# Altium schematic sheet [5] SCS.SchDoc
size A4
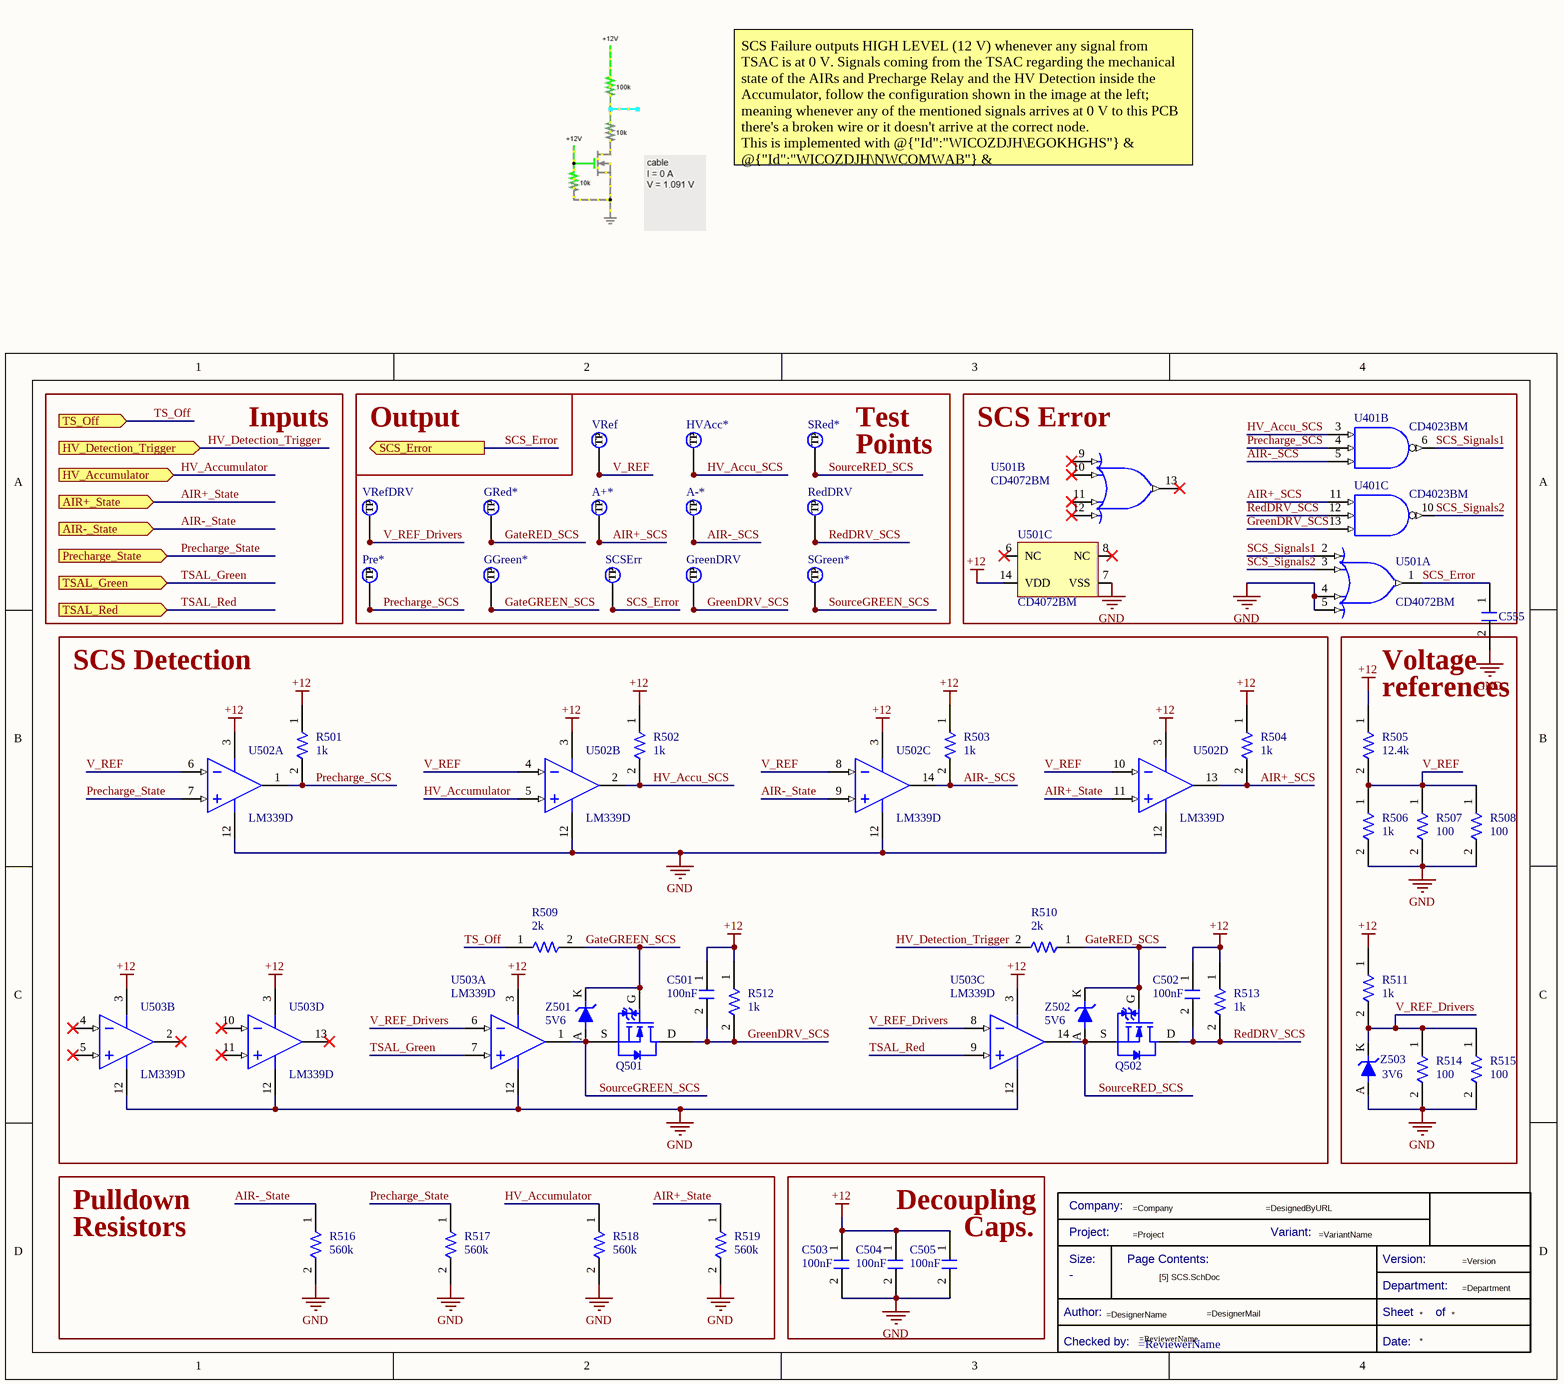
[diagram p0: [5] SCS.SchDoc]

## Parts
*  Title Block_template  (value not drawn)  (graphical)
A+*  TestPoint  [TestPoint]  (value not drawn)  (no BOM)
A-*  TestPoint  [TestPoint]  (value not drawn)  (no BOM)
C501  value 100nF  [C0805FNPC-R]  (hidden comment: C100n-50V-0805FNPC-X7R)
C502  value 100nF  [C0805FNPC-R]  (hidden comment: C100n-50V-0805FNPC-X7R)
C503  value 100nF  [C0805FNPC-R]  (hidden comment: C100n-50V-0805FNPC-X7R)
C504  value 100nF  [C0805FNPC-R]  (hidden comment: C100n-50V-0805FNPC-X7R)
C505  value 100nF  [C0805FNPC-R]  (hidden comment: C100n-50V-0805FNPC-X7R)
C555  C15p-50V-0805FNPC-NP0  [C0805FNPC-R]  (value not drawn)
GGreen*  TestPoint  [TestPoint]  (value not drawn)  (no BOM)
GRed*  TestPoint  [TestPoint]  (value not drawn)  (no BOM)
GreenDRV  TestPoint  [TestPoint]  (value not drawn)  (no BOM)
HVAcc*  TestPoint  [TestPoint]  (value not drawn)  (no BOM)
Pre*  TestPoint  [TestPoint]  (value not drawn)  (no BOM)
Q501  TRT-NCH-8/40-SQ  [TRT-NCH-3/35-CPH]  (value not drawn)
Q502  TRT-NCH-8/40-SQ  [TRT-NCH-3/35-CPH]  (value not drawn)
R501  value 1k  [R0805FTK]  (hidden comment: R1k-0805FTK)
R502  value 1k  [R0805FTK]  (hidden comment: R1k-0805FTK)
R503  value 1k  [R0805FTK]  (hidden comment: R1k-0805FTK)
R504  value 1k  [R0805FTK]  (hidden comment: R1k-0805FTK)
R505  value 12.4k  [0805]  (hidden comment: R12K4-0805-0.125W)
R506  value 1k  [0805]  (hidden comment: R1K-0805-0.5W)
R507  value 100  [R0805FTK]  (hidden comment: R100-0805FTK)
R508  value 100  [R0805FTK]  (hidden comment: R100-0805FTK)
R509  value 2k  [0805]  (hidden comment: R2K_0.5W_0805)
R510  value 2k  [0805]  (hidden comment: R2K_0.5W_0805)
R511  value 1k  [0805]  (hidden comment: R1K-0805-0.5W)
R512  value 1k  [R0805FTK]  (hidden comment: R1k-0805FTK)
R513  value 1k  [R0805FTK]  (hidden comment: R1k-0805FTK)
R514  value 100  [R0805FTK]  (hidden comment: R100-0805FTK)
R515  value 100  [R0805FTK]  (hidden comment: R100-0805FTK)
R516  value 560k  [0805]  (hidden comment: R560K-0805)
R517  value 560k  [0805]  (hidden comment: R560K-0805)
R518  value 560k  [0805]  (hidden comment: R560K-0805)
R519  value 560k  [0805]  (hidden comment: R560K-0805)
RedDRV  TestPoint  [TestPoint]  (value not drawn)  (no BOM)
SCSErr  TestPoint  [TestPoint]  (value not drawn)  (no BOM)
SGreen*  TestPoint  [TestPoint]  (value not drawn)  (no BOM)
SRed*  TestPoint  [TestPoint]  (value not drawn)  (no BOM)
U401  CD4023BM  [D0014A_N]  (parts B,C of 4)
U501  CD4072BM  [D0014A_N]  (parts A,B,C of 3)
U502  LM339D  [D0014A_N]  (parts A,B,C,D of 4)
U503  LM339D  [D0014A_N]  (parts A,B,C,D of 4)
VRef  TestPoint  [TestPoint]  (value not drawn)  (no BOM)
VRefDRV  TestPoint  [TestPoint]  (value not drawn)  (no BOM)
Z501  Zener Voltage: 5V6  [DO-214AC]  (hidden comment: DZ-5.6V-DO-214AC)
Z502  Zener Voltage: 5V6  [DO-214AC]  (hidden comment: DZ-5.6V-DO-214AC)
Z503  Zener Voltage: 3V6  [DZ-DO-214AC]  (hidden comment: DZ-3V6-1.25W-DO-214AC)

## Blocks framed on the sheet
SCS Error: C555 U401 U501
SCS Detection: C501 C502 Q501 Q502 R501-R504 R509 R510 R512 R513 U502 U503 Z501 Z502

## Ports
AIR+_State (in, see [2] Implausibilities[3B], [1] TSAL_Green[2A], [2] Implausibilities[1A], [3] Relay Implausibility[1A]), AIR-_State (in, see [2] Implausibilities[3B], [1] TSAL_Green[2A], [2] Implausibilities[1A], [3] Relay Implausibility[1A]), HV_Accumulator (in, see [2] Implausibilities[3B], [1] TSAL_Green[2B], [2] Implausibilities[1A], [4] NoHV_RelaysClosed[1A]), HV_Detection_Trigger (in, see [2] Implausibilities[4B], [1] TSAL_Green[2B], [2] Implausibilities[1A], [7] TSAL_Red[2A]), Precharge_State (in, see [2] Implausibilities[3C], [1] TSAL_Green[2A], [2] Implausibilities[1A], [3] Relay Implausibility[1A]), SCS_Error (out, see [2] Implausibilities[4C]), TS_Off (in, see [2] Implausibilities[3C], [1] TSAL_Green[4A], [2] Implausibilities[1A], [6] Green_Driver[1A]), TSAL_Green (in, see [2] Implausibilities[4B], [1] TSAL_Green[4A], [2] Implausibilities[1A], [6] Green_Driver[2A]), TSAL_Red (in, see [2] Implausibilities[4B], [1] TSAL_Green[3A], [2] Implausibilities[1A], [7] TSAL_Red[2A], [8] Red_Driver[2A])

## Nets
+12: C501.1 C502.1 C503.1 C504.1 C505.1 R501.1 R502.1 R503.1 R504.1 R505.1 R511.1 R512.1 R513.1 U501.14(VDD) U502.3(VCC) U503.3(VCC)
GND: C503.2 C504.2 C505.2 C555.2 R506.2 R507.2 R508.2 R514.2 R515.2 R516.2 R517.2 R518.2 R519.2 U501.4(C) U501.5(D) U501.7(VSS) U502.12(GND) U503.12(GND) Z503.A
AIR+_SCS: A+*.1(TP) R504.2 U401.11(I) U502.13(OUT4)
AIR+_State: R519.1 U502.11(IN4+) ; port AIR+_State
AIR-_SCS: A-*.1(TP) R503.2 U401.5(F) U502.14(OUT3)
AIR-_State: R516.1 U502.9(IN3+) ; port AIR-_State
GateGREEN_SCS: GGreen*.1(TP) Q501.G R509.2 Z501.K
GateRED_SCS: GRed*.1(TP) Q502.G R510.1 Z502.K
GreenDRV_SCS: C501.2 GreenDRV.1(TP) Q501.D R512.2 U401.13(G)
HV_Accu_SCS: HVAcc*.1(TP) R502.2 U401.3(D) U502.2(OUT2)
HV_Accumulator: R518.1 U502.5(IN2+) ; port HV_Accumulator
HV_Detection_Trigger: R510.2 ; port HV_Detection_Trigger
Precharge_SCS: Pre*.1(TP) R501.2 U401.4(E) U502.1(OUT1)
Precharge_State: R517.1 U502.7(IN1+) ; port Precharge_State
RedDRV_SCS: C502.2 Q502.D R513.2 RedDRV.1(TP) U401.12(H)
SCS_Error: C555.1 SCSErr.1(TP) U501.1(J) ; port SCS_Error
SCS_Signals1: U401.6(K) U501.2(A)
SCS_Signals2: U401.10(L) U501.3(B)
SourceGREEN_SCS: Q501.S SGreen*.1(TP) U503.1(OUT1) Z501.A
SourceRED_SCS: Q502.S SRed*.1(TP) U503.14(OUT3) Z502.A
TS_Off: R509.1 ; port TS_Off
TSAL_Green: U503.7(IN1+) ; port TSAL_Green
TSAL_Red: U503.9(IN3+) ; port TSAL_Red
V_REF: R505.2 R506.1 R507.1 R508.1 U502.4(IN2-) U502.6(IN1-) U502.8(IN3-) U502.10(IN4-) VRef.1(TP)
V_REF_Drivers: R511.2 R514.1 R515.1 U503.6(IN1-) U503.8(IN3-) VRefDRV.1(TP) Z503.K

Not connected (* = marked no-connect by the designer): U501 6(NC)* 8(NC)* 9(E)* 10(F)* 11(G)* 12(H)* 13(K)*; U503 2(OUT2)* 4(IN2-)* 5(IN2+)* 10(IN4-)* 11(IN4+)* 13(OUT4)*

## Notes on the sheet
- SCS Failure outputs HIGH LEVEL (12 V) whenever any signal from TSAC is at 0 V. Signals coming from the TSAC regarding the mechanical state of the AIRs and Precharge Relay and the HV Detection inside the Accumulator, follow the configuration shown in the image at the left; meaning whenever any of the mentioned signals arrives at 0 V to this PCB there's a broken wire or it doesn't arrive at the correct node.
  This is implemented with @{"Id":"WICOZDJH\EGOKHGHS"} & @{"Id":"WICOZDJH\NWCOMWAB"} & @{"Id":"WICOZDJH\OSDIWEFW"} & @{"Id":"WICOZDJH\TEKHYVMJ"}.
- Inputs
- Output
- (near SRed*) Test
- (near SRed*) Points
- Voltage
- references
- Pulldown
- Resistors
- Decoupling
- (near C505) Caps.
- (in symbol CMP-00043-8) Company:; Project:; Variant:; Size:; Page Contents:; Version:; Department:; Author:; Sheet; of; Checked by:; Date:

## Library data of the parts
* = CMP-00043-8: Standard Title Block; .SCHcheck: GP; Checked by:: =ReviewerName; Size: -; Design Item ID: Title Block_template; .PCBcheck: GP; .Creator: GP; Source: e-Tech_Racing.SchLib; Category: Title Block
A+* A-* GGreen* GRed* GreenDRV HVAcc* Pre* RedDRV SCSErr SGreen* SRed* VRef VRefDRV = CMP-00042-2: Test Point 1x1 mm; .SCHcheck: GP; Category: TestPoint; Source: e-Tech_Racing.SchLib; .Creator: GP; .PCBcheck: GP; Design Item ID: TestPoint
C501-C505 = CMP-00063-3: Cap, 0.1ΜF, 50V, 10%, X7R, 0805; Manufacturer Part Number 1: 885012207098; Manufacturer 1: Wurth Electronics; .Creator: DR; ComponentLink2Description: http://www.farnell.com/datasheets/1958498.pdf?src-supplier=Element14; ComponentLink1Description: http://www.farnell.com/datasheets/1958498.pdf?src-supplier=Farnell; Thickness: 0.035inch; ComponentLink1URL: http://www.farnell.com/datasheets/1958498.pdf?src-supplier=Farnell; Min Operating Temperature: -55°C; Packaging: Cut Tape; ComponentLink2URL: http://www.farnell.com/datasheets/1958498.pdf?src-supplier=Element14; Mount: Surface Mount; Voltage Rating (DC): 50V; Tolerance: 10%; Category: Ceramic Capacitors; RoHS: Yes; Width: 0.049inch; Pricing 1: 100=0,10200, 500=0,07100, 2000=0,06100 (GBP); RoHS Compliant: Yes; ComponentLink4Description: http://www.farnell.com/datasheets/1958498.pdf?src-supplier=Newark; Dielectric: X7R; Stock 1: 8000; Length: 0.079inch; ComponentLink3URL: https://katalog.we-online.de/pbs/datasheet/885012207098.pdf?src-supplier=Digi-Key; ComponentLink3Description: https://katalog.we-online.de/pbs/datasheet/885012207098.pdf?src-supplier=Digi-Key; Design Item ID: C100n-50V-0805FNPC-X7R; ComponentLink4URL: http://www.farnell.com/datasheets/1958498.pdf?src-supplier=Newark; REACH SVHC: Unknown; Case Code (Metric): 2012; Voltage Rating: 50V; Max Operating Temperature: 125°C; Source: Passives.SchLib; Case/Package: 0805
C555 = CMP-00056-3: Cap, 15PF, 50V, 5%, C0G/NP0, 0805; Manufacturer Part Number 1: 885012007052; Manufacturer 1: Wurth Electronics; .Creator: DR; Thickness: 0.028inch; RoHS Compliant: Yes; ComponentLink2URL: http://katalog.we-online.de/pbs/datasheet/885012007052.pdf?src-supplier=Digi-Key; Design Item ID: C15p-50V-0805FNPC-NP0; Case Code (Metric): 2012; Max Operating Temperature: 125°C; Mount: Surface Mount; Category: Ceramic Capacitors; Min Operating Temperature: -55°C; Case/Package: 0805; ComponentLink3Description: https://katalog.we-online.de/pbs/datasheet/885012007052.pdf?src-supplier=Digi-Key; ComponentLink1Description: http://www.farnell.com/datasheets/2031702.pdf?src-supplier=Farnell; ComponentLink1URL: http://www.farnell.com/datasheets/2031702.pdf?src-supplier=Farnell; RoHS: Yes; Voltage Rating: 50V; Length: 0.079inch; Source: Passives.SchLib; Value: 15pF; Pricing 1: 1=0,10800, 10=0,05200, 25=0,05100, 50=0,04900, 100=0,04800, 250=0,04600, 500=0,04300 (USD); Tolerance: 5%; ComponentLink3URL: https://katalog.we-online.de/pbs/datasheet/885012007052.pdf?src-supplier=Digi-Key; Stock 1: 815; Packaging: Cut Tape; Width: 0.049inch; ComponentLink2Description: http://katalog.we-online.de/pbs/datasheet/885012007052.pdf?src-supplier=Digi-Key
Q501 Q502 = CMP-00142-1: Automotive N-channel 40 V (d-s) 175C Mosfet SOT-23; Manufacturer Part Number 1: SQ2318BES-T1_GE3; Manufacturer 1: Vishay; Vds: 40V; .Creator: DO; Pricing 1: 1=0,71500, 5=0,71500, 10=0,64400, 25=0,59000, 50=0,52500, 100=0,47100, 250=0,40800 (USD); RoHS: No; ComponentLink2Description: Datasheet; ComponentLink1Description: Where to buy; Design Item ID: TRT-NCH-8/40-SQ; Source: Semiconductor.SchLib; ComponentLink2URL: https://www.mouser.es/datasheet/2/427/sq2318bes-1868475.pdf; ComponentLink1URL: https://www.mouser.es/ProductDetail/Vishay-Siliconix/SQ2318BES-T1_GE3?qs=sPbYRqrBIVmyZcxPsDt0vA%3D%3D
R501-R504 R512 R513 = CMP-00076-3: Res Thick Film 0805 1K Ohm 5% 1/8W ±200ppm/°C Molded SMD SMD Paper Tape on Plastic Reel; Manufacturer Part Number 1: CR0805-JW-102ELF; Manufacturer 1: Bourns; Voltage Rating (DC): 150V; Power Rating: 125mW; .Creator: GP; Number of Terminations: 2; REACH SVHC: No SVHC; ComponentLink3URL: https://datasheet.ciiva.com/22693/1902866-22693253.pdf?src-supplier=Element14; ComponentLink1URL: https://datasheet.ciiva.com/11821/0900766b80fcdb72-11821134.pdf?src-supplier=RSComponents; ComponentLink1Description: https://datasheet.ciiva.com/11821/0900766b80fcdb72-11821134.pdf?src-supplier=RSComponents; Category: Chip SMD Resistors; Stock 1: 27510; Case/Package: 0805; ComponentLink3Description: https://datasheet.ciiva.com/22693/1902866-22693253.pdf?src-supplier=Element14; Length: 2mm; ComponentLink5URL: https://datasheet.ciiva.com/7985/1856384-7985867.pdf?src-supplier=Element14; ComponentLink7Description: https://datasheet.ciiva.com/6547/chpreztr-6547359.pdf?src-supplier=Digi-Key; Package Quantity: 1; Tolerance: 5%; Lead Free: Lead Free; RoHS: Yes; Contact Plating: Tin; ComponentLink2Description: https://datasheet.ciiva.com/15225/getdatasheetpartid-78155-15225381.pdf?src-supplier=Verical; ComponentLink5Description: https://datasheet.ciiva.com/7985/1856384-7985867.pdf?src-supplier=Element14; Depth: 1.25mm; Thickness: 508um; Resistor Type: Thick Film; Design Item ID: R1k-0805FTK; ComponentLink2URL: https://datasheet.ciiva.com/15225/getdatasheetpartid-78155-15225381.pdf?src-supplier=Verical; Max Operating Temperature: 155°C; ComponentLink6URL: https://datasheet.ciiva.com/30242/159chpreztr-30242765.pdf?src-supplier=Onlinecomponents.com; ComponentLink4URL: https://datasheet.ciiva.com/7986/1856384-7986184.pdf?src-supplier=Element14; Military Standard: Not; Case Code (Metric): 2012; Temperature Coefficient: 200ppm/°C; Pricing 1: 1=0,05930, 10=0,03510, 25=0,01790, 100=0,00800, 250=0,00790, 500=0,00590, 1000=0,00360, 3000=0,00350, 6000=0,00250 (USD); Min Operating Temperature: -55°C; ComponentLink7URL: https://datasheet.ciiva.com/6547/chpreztr-6547359.pdf?src-supplier=Digi-Key; Width: 1.25mm; Source: Passives.SchLib; Max Power Dissipation: 125mW; Voltage Rating: 150V; ComponentLink4Description: https://datasheet.ciiva.com/7986/1856384-7986184.pdf?src-supplier=Element14; Features: Moisture Resistant; Mount: Surface Mount; Termination: SMD/SMT; Height: 0.5mm; Radiation Hardening: No; ComponentLink6Description: https://datasheet.ciiva.com/30242/159chpreztr-30242765.pdf?src-supplier=Onlinecomponents.com; Pins: 2; Packaging: Tape and Reel
R505 = CMP-009-00046-1: Fixed Resistor, Metal Glaze/thick Film, 0.125W, 12400ohm, 150V, 1% +/-Tol, 100ppm/Cel, Surface Mount, 0805; Power: 125mW; Pins: 2; Max Operating Temperature: 155°C; Case/Package: 0805; Tolerance: 1%; Min Operating Temperature: -55°C; Mounting Technology: Surface Mount; RoHS Compliant: Yes
R506 R511 = CMP-009-00043-2: Fixed Resistor, Metal Glaze/thick Film, 0.5W, 1000ohm, 150V, 1% +/-Tol, 100ppm/Cel, Surface Mount, 0805; Power: 500mW; Pins: 2; RoHS Compliant: Yes; Tolerance: 1%; Case/Package: 0805; Min Operating Temperature: -55°C; Mounting Technology: Surface Mount; Max Operating Temperature: 155°C
R507 R508 R514 R515 = CMP-00083-3: Res Thick Film 0805 100 Ohm 1% 1/8W ±100ppm/°C Molded SMD SMD Paper Tape on Plastic Reel; Manufacturer 1: Bourns; Manufacturer Part Number 1: CR0805-FX-1000ELF; .Creator: DR; Voltage Rating: 150V; Power Rating: 125mW; Stock 1: 49802; Category: Chip SMD Resistors; Number of Terminations: 2; RoHS Compliant: Yes; Package Quantity: 1; Case/Package: 0805; Features: Moisture Resistant; Source: Passives.SchLib; Military Standard: Not; Construction: Rectangular; RoHS: Yes; Packaging: Tape and Reel; ComponentLink3URL: https://datasheet.ciiva.com/6547/chpreztr-6547414.pdf?src-supplier=Digi-Key; Resistance Tolerance: 1%; Termination: SMD/SMT; Height: 0.5mm; Radiation Hardening: No; Pricing 1: 1=0,05840, 10=0,03430, 25=0,01780, 100=0,00750, 250=0,00560, 500=0,00490, 3000=0,00470 (USD); ComponentLink2URL: https://datasheet.ciiva.com/6547/chpreztr-6547413.pdf?src-supplier=Digi-Key; ComponentLink5Description: https://datasheet.ciiva.com/9120/chpreztr-9120744.pdf?src-supplier=Avnet; Pins: 2; ComponentLink4URL: https://datasheet.ciiva.com/6547/chpreztr-6547415.pdf?src-supplier=Digi-Key; Temperature Coefficient: 100ppm/°C; Resistor Type: Thick Film; ComponentLink3Description: https://datasheet.ciiva.com/6547/chpreztr-6547414.pdf?src-supplier=Digi-Key; Width: 1.25mm; ComponentLink4Description: https://datasheet.ciiva.com/6547/chpreztr-6547415.pdf?src-supplier=Digi-Key; Length: 2mm; ComponentLink5URL: https://datasheet.ciiva.com/9120/chpreztr-9120744.pdf?src-supplier=Avnet; Case Code (Metric): 2012; Design Item ID: R100-0805FTK; ComponentLink1Description: https://datasheet.ciiva.com/11809/0900766b80fcdb72-11809178.pdf?src-supplier=RSComponents; ComponentLink1URL: https://datasheet.ciiva.com/11809/0900766b80fcdb72-11809178.pdf?src-supplier=RSComponents; Thickness: 508um; ComponentLink2Description: https://datasheet.ciiva.com/6547/chpreztr-6547413.pdf?src-supplier=Digi-Key; Series: CR0805; Min Operating Temperature: -55°C; REACH SVHC: No SVHC; Technology: THICK FILM; Contact Plating: Tin; Tolerance: 1%; Max Operating Temperature: 155°C; Max Power Dissipation: 125mW; Voltage Rating (DC): 150V; Depth: 1.25mm; Mount: Surface Mount
R509 R510 = CMP-009-00027-3: Fixed Resistor, Metal Glaze/thick Film, 0.5W, 2000ohm, 150V, 1% +/-Tol, 100ppm/Cel, Surface Mount, 0805; Manufacturer: Vishay; Part Number: CRCW08052K00FKEAHP; Power: 500mW; Min Operating Temperature: -55°C; Max Operating Temperature: 155°C; RoHS Compliant: Yes; Tolerance: 1%; Mounting Technology: Surface Mount; Pins: 2; Case/Package: 0805
R516-R519 = CMP-009-00008-6: Fixed Resistor, Metal Glaze/thick Film, 0.125W, 560000ohm, 150V, 1% +/-Tol, 100ppm/Cel, Surface Mount, 0805; Power: 125mW; Max Operating Temperature: 155°C; RoHS Compliant: Yes; Min Operating Temperature: -55°C; Mounting Technology: Surface Mount; Pins: 2; Case/Package: 0805; Tolerance: 1%
U401 = CMP-00215-1: NAND Gate, 4000/14000/40000 Series, 3-Func, 3-Input, CMOS, CDIP14; Min Supply Voltage: 5V; Package Body Material: Metal; Surface Mount: No; Number of Inputs: 3; Max Supply Voltage: 15V; Qualification Status: Not Qualified; Nominal Supply Voltage: 10V; Propagation Delay (tpd): 250ns; Pins: 14; Case/Package: DIP; Terminal Pitch: 2.54mm; Terminal Form: Through Hole; Height - Seated (Max): 5.08mm; Max Operating Temperature: 125°C; Min Operating Temperature: -55°C; Package Shape: Rectangular; Width: 7.62mm; Logic Type: NAND GATE; Technology: CMOS; Channels: 3; Temperature Grade: MILITARY; Terminal Position: DUAL; Package Style: IN-LINEMeter
U501 = CMP-00217-1: OR Gate, 4000/14000/40000 Series, 2-Func, 4-Input, CMOS, PDSO14; Package Equivalence Code: SOP14,.25; Package Body Material: Plastic; Power Supplies: 5/15V; Schmitt Trigger: No; Propagation Delay (tpd): 250ns; Nominal Supply Voltage: 5V; Min Supply Voltage: 3V; Channels: 2; Output Characteristics: OPEN-COLLECTOR; Max Supply Voltage: 18V; Load Capacitance (CL): 50pF; Logic Type: OR GATE; Qualification Status: Not Qualified; Number of Inputs: 4; Length: 8.65mm; Technology: CMOS; Surface Mount: Yes; Packaging: Rail/Tube; JESD-609 Code: e4; Terminal Pitch: 1.27mm; Package Shape: Rectangular; Package Style: SMALL OUTLINEMeter; Max Operating Temperature: 125°C; Terminal Position: DUAL; Reach SVHC Compliant: Yes; Terminal Form: Gull Wing; JESD-30 Code: R-PDSO-G14; Width: 3.9mm; Moisture Sensitivity Level: 1; Peak Reflow Temperature (Cel): 260°C; Temperature Grade: MILITARY; Pins: 14; Case/Package: SOP; Terminal Finish: Nickel; Min Operating Temperature: -55°C; Height - Seated (Max): 1.75mm; Prop. Delay@Nom-Sup: 250ns; RoHS Compliant: Yes
U502 U503 = CMP-014-00006-1: Comparator, 4 Func, 5000uV Offset-Max, 300ns Response Time, BIPolar, PDSO14; Nominal Supply Voltage: 5V; Channels: 4; Output Type: OPEN-COLLECTOR; Case/Package: SOP; Pins: 14; Max Operating Temperature: 70°C; Min Operating Temperature: 0°C; RoHS Compliant: Yes
Z501 Z502 = CMP-004-00007-3: Zener Diode, 5.6V V(Z), 5%, 0.5W, Silicon, Unidirectional, DO-214AC; Pins: 2; RoHS Compliant: Yes; Min Operating Temperature: -65°C; Max Operating Temperature: 150°C
Z503 = CMP-004-00020-2: Zener Diode, 3.6V V(Z), 5.56%, 1.25W, Silicon, Unidirectional, DO-214AC, BZG05C3V6-M3-08; Max Operating Temperature: 150°C; RoHS Compliant: Yes; Pins: 2